# Altium schematic sheet Cpcis_connectors_P1_P2_P3.SchDoc: CPCIS Backplane
size 420 x 297 mm; CheckedBy: A.Paixao; CompanyName: CERN; DrawnBy: G. Daniluk; Engineer: G. Daniluk; Organization: CERN; Address1: European Organization for Nuclear Research; Address2: CH-1211 Genève 23 - Switzerland; DocumentNumber: 18; SheetNumber: 18; SheetTotal: 19; Title2: P1 to P4; DivGrp: BE/CO; Designer: G. Daniluk; EDA_Number: EDA-03828-V1-0; Projet: DIOT Demonstrator System Board (based on C-GEFE v1); ModifiedBy: G. Daniluk; CheckedDate: 18/06/2018; ProjectName: Distributed I/O Tier
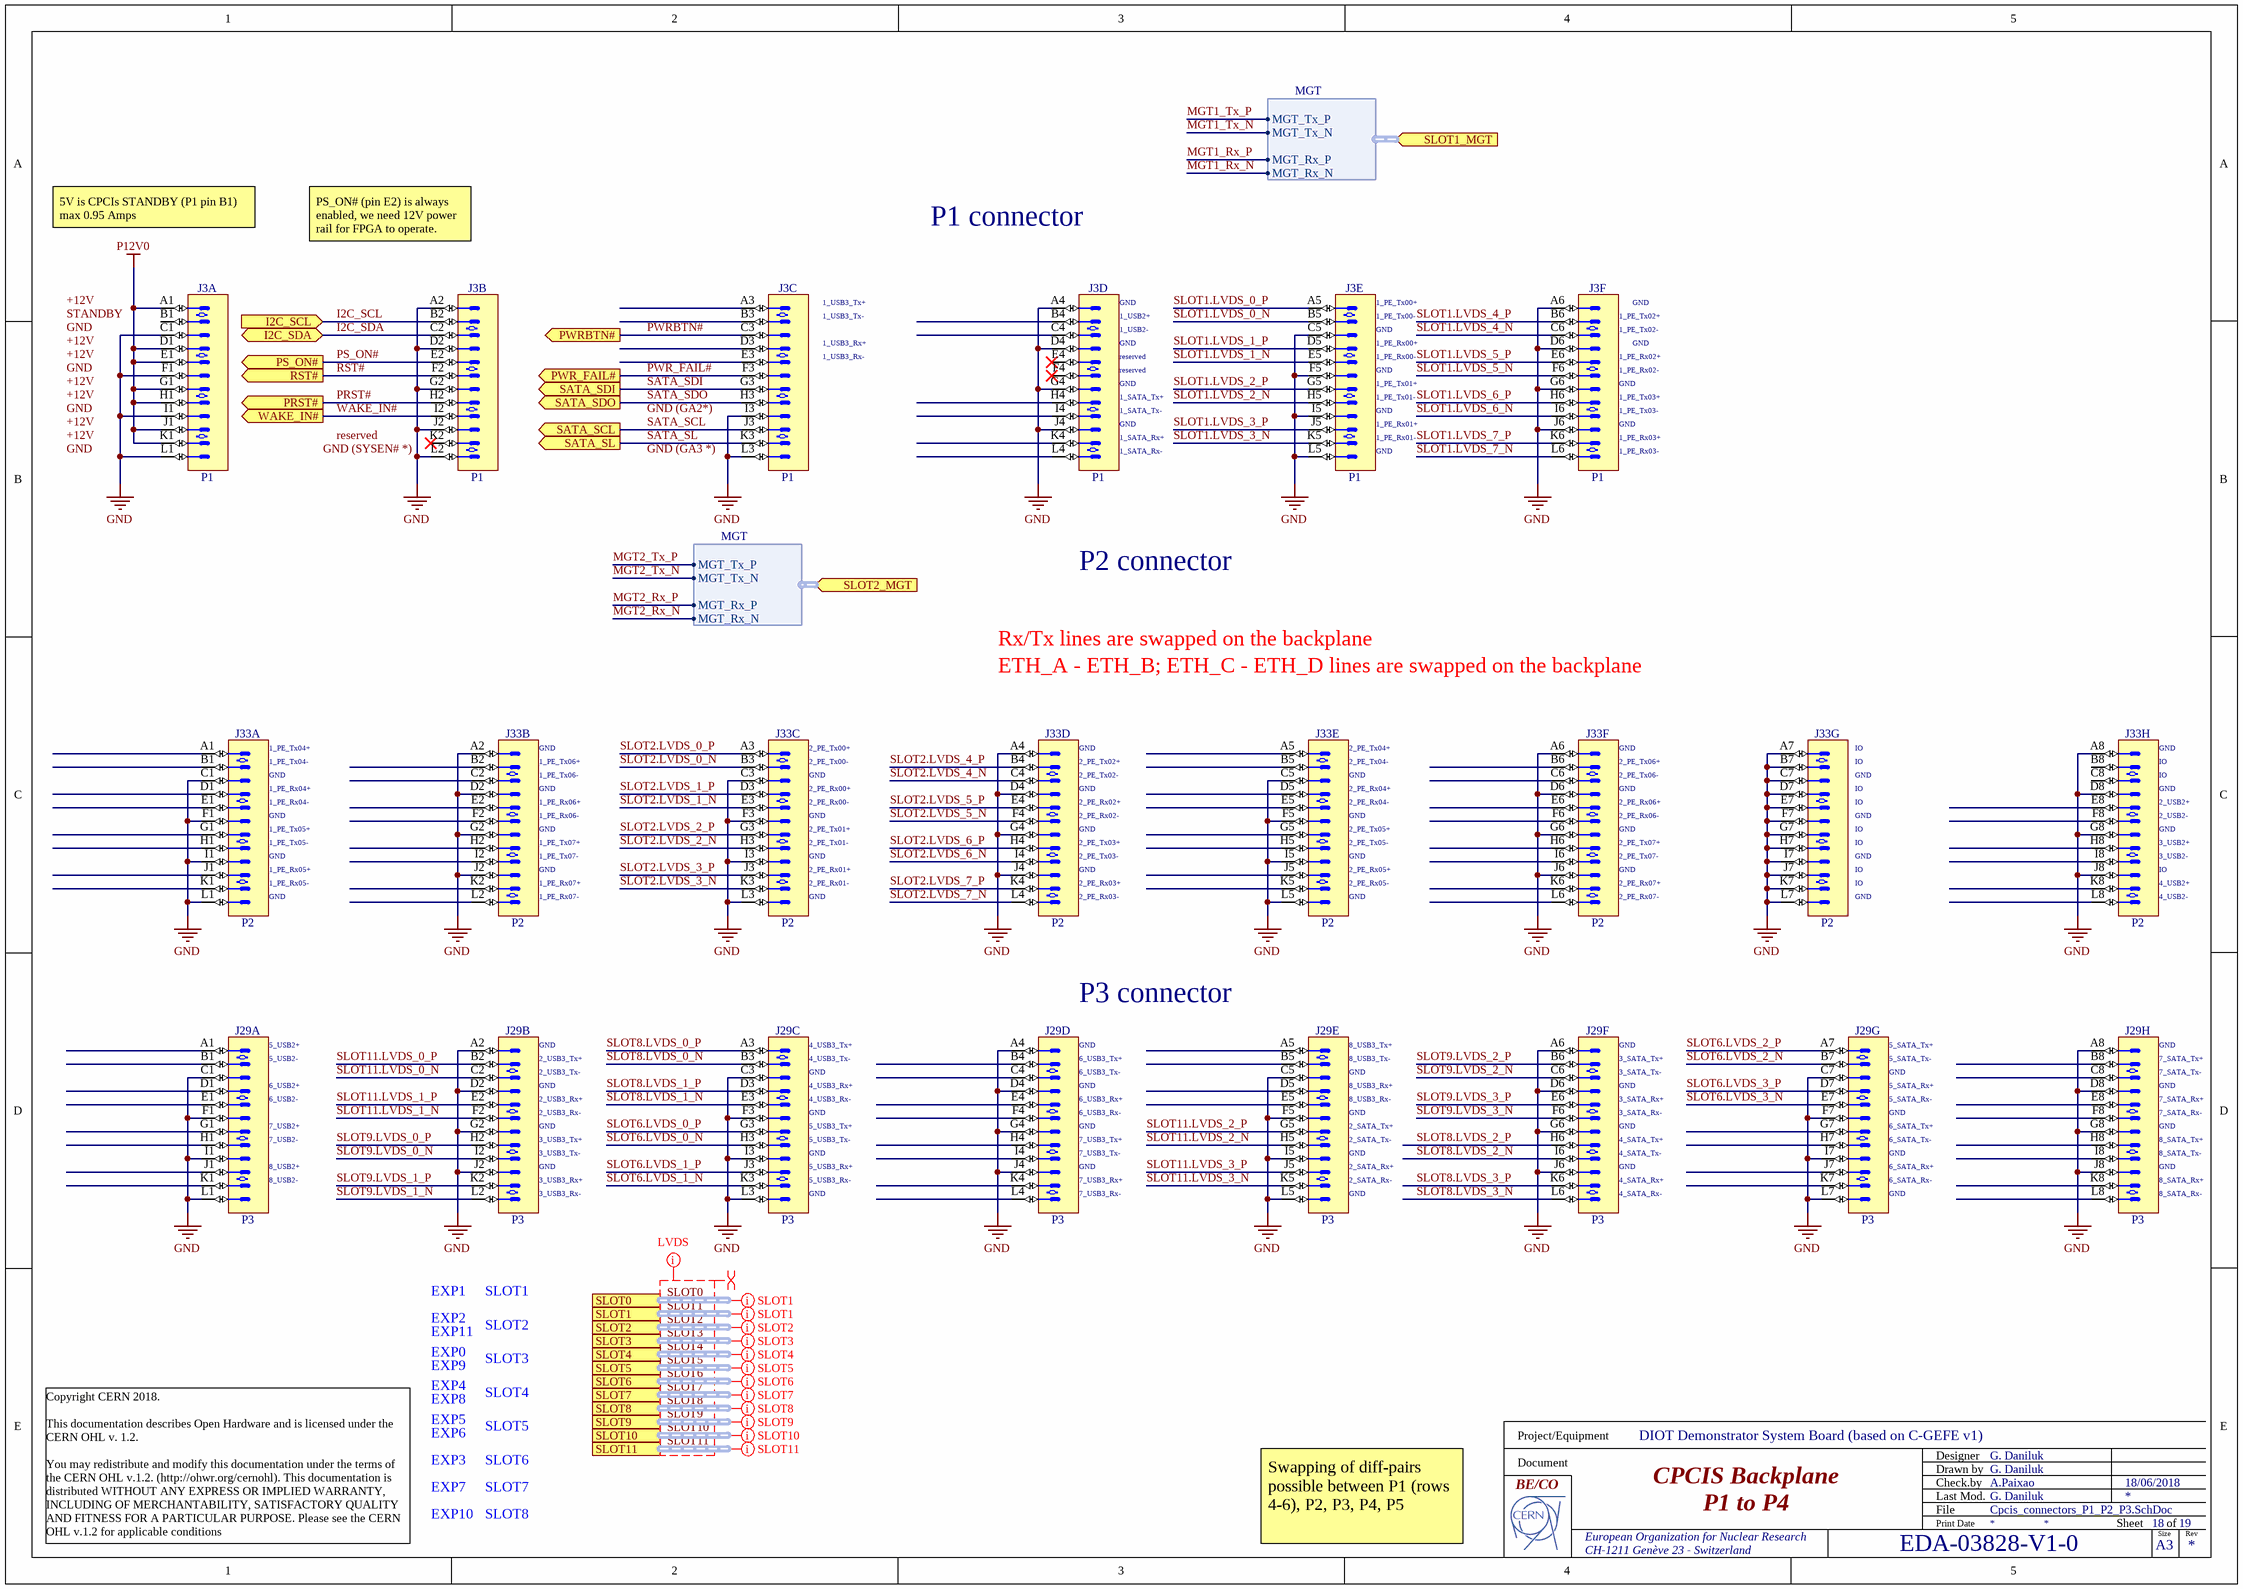
[diagram p0: Cpcis_connectors_P1_P2_P3.SchDoc]

## Parts
J3  P1  [AMPHENOL_10052825-101LF]  (parts A,B,C,D,E,F of 6)
J29  P3  [AMPHENOL_10052837-101LF]  (parts A,B,C,D,E,F,G,H of 8)
J33  P2  [AMPHENOL_10052837-101LF]  (parts A,B,C,D,E,F,G,H of 8)

## Ports
I2C_SCL (in), I2C_SDA (bidir), PRST# (out), PS_ON# (out), PWR_FAIL# (out), PWRBTN# (out), RST# (out), SATA_SCL (out), SATA_SDI (out), SATA_SDO (out), SATA_SL (out), SLOT0 (harness ExtensionConnector), SLOT1 (harness ExtensionConnector), SLOT1_MGT (in, harness MGT), SLOT2 (harness ExtensionConnector), SLOT2_MGT (in, harness MGT), SLOT3 (harness ExtensionConnector), SLOT4 (harness ExtensionConnector), SLOT5 (harness ExtensionConnector), SLOT6 (harness ExtensionConnector), SLOT7 (harness ExtensionConnector), SLOT8 (harness ExtensionConnector), SLOT9 (harness ExtensionConnector), SLOT10 (harness ExtensionConnector), SLOT11 (harness ExtensionConnector), WAKE_IN# (out)

## Harnesses
MGT: MGT_Tx_P, MGT_Tx_N, MGT_Rx_P, MGT_Rx_N

## Nets
GND: J3.A2 J3.A4 J3.A6 J3.C1 J3.C5 J3.D2 J3.D4 J3.D6 J3.F1 J3.F5 J3.G2 J3.G4 J3.G6 J3.I1 J3.I3 J3.I5 J3.J2 J3.J4 J3.J6 J3.L1 J3.L2 J3.L3 J3.L5 J29.A2 J29.A4 J29.A6 J29.A8 J29.C1 J29.C3 J29.C5 J29.C7 J29.D2 J29.D4 J29.D6 J29.D8 J29.F1 J29.F3 J29.F5 J29.F7 J29.G2 J29.G4 J29.G6 J29.G8 J29.I1 J29.I3 J29.I5 J29.I7 J29.J2 J29.J4 J29.J6 J29.J8 J29.L1 J29.L3 J29.L5 J29.L7 J33.A2 J33.A4 J33.A6 J33.A7 J33.A8 J33.B7 J33.C1 J33.C3 J33.C5 J33.C7 J33.D2 J33.D4 J33.D6 J33.D7 J33.D8 J33.E7 J33.F1 J33.F3 J33.F5 J33.F7 J33.G2 J33.G4 J33.G6 J33.G7 J33.G8 J33.H7 J33.I1 J33.I3 J33.I5 J33.I7 J33.J2 J33.J4 J33.J6 J33.J7 J33.J8 J33.K7 J33.L1 J33.L3 J33.L5 J33.L7
P12V0: J3.A1 J3.D1 J3.E1 J3.G1 J3.H1 J3.J1 J3.K1
I2C_SCL: J3.B2 ; port I2C_SCL
I2C_SDA: J3.C2 ; port I2C_SDA
MGT1_Rx_N: port SLOT1_MGT.MGT_Rx_N
MGT1_Rx_P: port SLOT1_MGT.MGT_Rx_P
MGT1_Tx_N: port SLOT1_MGT.MGT_Tx_N
MGT1_Tx_P: port SLOT1_MGT.MGT_Tx_P
MGT2_Rx_N: port SLOT2_MGT.MGT_Rx_N
MGT2_Rx_P: port SLOT2_MGT.MGT_Rx_P
MGT2_Tx_N: port SLOT2_MGT.MGT_Tx_N
MGT2_Tx_P: port SLOT2_MGT.MGT_Tx_P
PRST#: J3.H2 ; port PRST#
PS_ON#: J3.E2 ; port PS_ON#
PWR_FAIL#: J3.F3 ; port PWR_FAIL#
PWRBTN#: J3.C3 ; port PWRBTN#
RST#: J3.F2 ; port RST#
SATA_SCL: J3.J3 ; port SATA_SCL
SATA_SDI: J3.G3 ; port SATA_SDI
SATA_SDO: J3.H3 ; port SATA_SDO
SATA_SL: J3.K3 ; port SATA_SL
SLOT1.LVDS_0_N: J3.B5
SLOT1.LVDS_0_P: J3.A5
SLOT1.LVDS_1_N: J3.E5
SLOT1.LVDS_1_P: J3.D5
SLOT1.LVDS_2_N: J3.H5
SLOT1.LVDS_2_P: J3.G5
SLOT1.LVDS_3_N: J3.K5
SLOT1.LVDS_3_P: J3.J5
SLOT1.LVDS_4_N: J3.C6
SLOT1.LVDS_4_P: J3.B6
SLOT1.LVDS_5_N: J3.F6
SLOT1.LVDS_5_P: J3.E6
SLOT1.LVDS_6_N: J3.I6
SLOT1.LVDS_6_P: J3.H6
SLOT1.LVDS_7_N: J3.L6
SLOT1.LVDS_7_P: J3.K6
SLOT2.LVDS_0_N: J33.B3
SLOT2.LVDS_0_P: J33.A3
SLOT2.LVDS_1_N: J33.E3
SLOT2.LVDS_1_P: J33.D3
SLOT2.LVDS_2_N: J33.H3
SLOT2.LVDS_2_P: J33.G3
SLOT2.LVDS_3_N: J33.K3
SLOT2.LVDS_3_P: J33.J3
SLOT2.LVDS_4_N: J33.C4
SLOT2.LVDS_4_P: J33.B4
SLOT2.LVDS_5_N: J33.F4
SLOT2.LVDS_5_P: J33.E4
SLOT2.LVDS_6_N: J33.I4
SLOT2.LVDS_6_P: J33.H4
SLOT2.LVDS_7_N: J33.L4
SLOT2.LVDS_7_P: J33.K4
SLOT6.LVDS_0_N: J29.H3
SLOT6.LVDS_0_P: J29.G3
SLOT6.LVDS_1_N: J29.K3
SLOT6.LVDS_1_P: J29.J3
SLOT6.LVDS_2_N: J29.B7
SLOT6.LVDS_2_P: J29.A7
SLOT6.LVDS_3_N: J29.E7
SLOT6.LVDS_3_P: J29.D7
SLOT8.LVDS_0_N: J29.B3
SLOT8.LVDS_0_P: J29.A3
SLOT8.LVDS_1_N: J29.E3
SLOT8.LVDS_1_P: J29.D3
SLOT8.LVDS_2_N: J29.I6
SLOT8.LVDS_2_P: J29.H6
SLOT8.LVDS_3_N: J29.L6
SLOT8.LVDS_3_P: J29.K6
SLOT9.LVDS_0_N: J29.I2
SLOT9.LVDS_0_P: J29.H2
SLOT9.LVDS_1_N: J29.L2
SLOT9.LVDS_1_P: J29.K2
SLOT9.LVDS_2_N: J29.C6
SLOT9.LVDS_2_P: J29.B6
SLOT9.LVDS_3_N: J29.F6
SLOT9.LVDS_3_P: J29.E6
SLOT11.LVDS_0_N: J29.C2
SLOT11.LVDS_0_P: J29.B2
SLOT11.LVDS_1_N: J29.F2
SLOT11.LVDS_1_P: J29.E2
SLOT11.LVDS_2_N: J29.H5
SLOT11.LVDS_2_P: J29.G5
SLOT11.LVDS_3_N: J29.K5
SLOT11.LVDS_3_P: J29.J5
WAKE_IN#: J3.I2 ; port WAKE_IN#

Not connected (* = marked no-connect by the designer): J3 A3 B1 B3 B4 C4 D3 E3 E4* F4* H4 I4 K2* K4 L4; J29 A1 A5 B1 B4 B5 B8 C4 C8 D1 D5 E1 E4 E5 E8 F4 F8 G1 G7 H1 H4 H7 H8 I4 I8 J1 J7 K1 K4 K7 K8 L4 L8; J33 A1 A5 B1 B2 B5 B6 B8 C2 C6 C8 D1 D5 E1 E2 E5 E6 E8 F2 F6 F8 G1 G5 H1 H2 H5 H6 H8 I2 I6 I8 J1 J5 K1 K2 K5 K6 K8 L2 L6 L8

## Buses and harness runs
harness SLOT0 = port SLOT0
harness SLOT1 = port SLOT1
harness SLOT2 = port SLOT2
harness SLOT3 = port SLOT3
harness SLOT4 = port SLOT4
harness SLOT5 = port SLOT5
harness SLOT6 = port SLOT6
harness SLOT7 = port SLOT7
harness SLOT8 = port SLOT8
harness SLOT9 = port SLOT9
harness SLOT10 = port SLOT10
harness SLOT11 = port SLOT11

## Layout directives
net class LVDS: SLOT0, SLOT1, SLOT2, SLOT3, SLOT4, SLOT5, SLOT6, SLOT7, SLOT8, SLOT9, SLOT10, SLOT11
net class SLOT1: (no net found under the mark)
net class SLOT2: (no net found under the mark)
net class SLOT3: (no net found under the mark)
net class SLOT4: (no net found under the mark)
net class SLOT5: (no net found under the mark)
net class SLOT6: (no net found under the mark)
net class SLOT7: (no net found under the mark)
net class SLOT8: (no net found under the mark)
differential pair: SLOT0, SLOT1, SLOT2, SLOT3, SLOT4, SLOT5, SLOT6, SLOT7, SLOT8, SLOT9, SLOT10, SLOT11
net class SLOT9: (no net found under the mark)
net class SLOT10: (no net found under the mark)
net class SLOT11: (no net found under the mark)
net class SLOT0: (no net found under the mark)

## Notes on the sheet
- 5V is CPCIs STANDBY (P1 pin B1)
  max 0.95 Amps
- PS_ON# (pin E2) is always enabled, we need 12V power rail for FPGA to operate.
- P1 connector
- 1_USB3_Tx+
- 1_USB3_Tx-
- (near J3) 1_USB2+
- (near J3) GND
- (near J3) 1_PE_Tx00+
- (near J3) 1_PE_Tx00-
- (near J3) 1_PE_Tx02+
- GND
- 1_USB3_Rx+
- 1_USB3_Rx-
- (near J3) 1_USB2-
- (near J3) 1_SATA_Tx+
- (near J3) reserved
- (near J3) 1_PE_Tx01+
- (near J3) 1_PE_Tx01-
- (near J3) 1_PE_Rx00+
- (near J3) 1_PE_Rx00-
- (near J3) 1_PE_Tx02-
- (near J3) 1_PE_Rx02+
- (near J3) 1_PE_Rx02-
- (near J3) 1_PE_Tx03+
- (near J3) 1_SATA_Tx-
- (near J3) 1_SATA_Rx+
- (near J3) 1_SATA_Rx-
- (near J3) 1_PE_Rx01+
- (near J3) 1_PE_Rx01-
- (near J3) 1_PE_Tx03-
- (near J3) 1_PE_Rx03+
- (near J3) 1_PE_Rx03-
- P2 connector
- Rx/Tx lines are swapped on the backplane
- ETH_A - ETH_B; ETH_C - ETH_D lines are swapped on the backplane
- (near J33) 1_PE_Tx04+
- (near J33) 1_PE_Tx04-
- (near J33) GND
- (near J33) 1_PE_Rx04+
- (near J33) 1_PE_Rx04-
- (near J33) 1_PE_Tx06+
- (near J33) 1_PE_Tx06-
- (near J33) 1_PE_Rx06+
- (near J33) 2_PE_Tx00+
- (near J33) 2_PE_Tx00-
- (near J33) 2_PE_Rx00+
- (near J33) 2_PE_Rx00-
- (near J33) 2_PE_Tx02+
- (near J33) 2_PE_Tx02-
- (near J33) 2_PE_Rx02+
- (near J33) 2_PE_Tx04+
- (near J33) 2_PE_Tx04-
- (near J33) 2_PE_Rx04+
- (near J33) 2_PE_Rx04-
- (near J33) 2_PE_Tx06+
- (near J33) 2_PE_Tx06-
- (near J33) 2_PE_Rx06+
- (near J33) IO
- (near J33) 2_USB2+
- (near J33) 1_PE_Tx05+
- (near J33) 1_PE_Tx05-
- (near J33) 1_PE_Rx06-
- (near J33) 1_PE_Tx07+
- (near J33) 1_PE_Tx07-
- (near J33) 2_PE_Tx01+
- (near J33) 2_PE_Tx01-
- (near J33) 2_PE_Rx02-
- (near J33) 2_PE_Tx03+
- (near J33) 2_PE_Tx03-
- (near J33) 2_PE_Tx05+
- (near J33) 2_PE_Tx05-
- (near J33) 2_PE_Rx06-
- (near J33) 2_PE_Tx07+
- (near J33) 2_PE_Tx07-
- (near J33) 2_USB2-
- (near J33) 3_USB2+
- (near J33) 3_USB2-
- (near J33) 1_PE_Rx05+
- (near J33) 1_PE_Rx05-
- (near J33) 1_PE_Rx07+
- (near J33) 1_PE_Rx07-
- (near J33) 2_PE_Rx01+
- (near J33) 2_PE_Rx01-
- (near J33) 2_PE_Rx03+
- (near J33) 2_PE_Rx03-
- (near J33) 2_PE_Rx05+
- (near J33) 2_PE_Rx05-
- (near J33) 2_PE_Rx07+
- (near J33) 2_PE_Rx07-
- (near J33) 4_USB2+
- (near J33) 4_USB2-
- (near J29) 5_USB2+
- (near J29) 5_USB2-
- (near J29) GND
- (near J29) 2_USB3_Tx+
- (near J29) 2_USB3_Tx-
- (near J29) 4_USB3_Tx+
- (near J29) 4_USB3_Tx-
- P3 connector
- (near J29) 6_USB3_Tx+
- (near J29) 6_USB3_Tx-
- (near J29) 8_USB3_Tx+
- (near J29) 8_USB3_Tx-
- (near J29) 3_SATA_Tx+
- (near J29) 3_SATA_Tx-
- (near J29) 5_SATA_Tx+
- (near J29) 5_SATA_Tx-
- (near J29) 7_SATA_Tx+
- (near J29) 7_SATA_Tx-
- (near J29) 6_USB2+
- (near J29) 6_USB2-
- (near J29) 7_USB2+
- (near J29) 2_USB3_Rx+
- (near J29) 2_USB3_Rx-
- (near J29) 4_USB3_Rx+
- (near J29) 4_USB3_Rx-
- (near J29) 5_USB3_Tx+
- (near J29) 6_USB3_Rx+
- (near J29) 6_USB3_Rx-
- (near J29) 8_USB3_Rx+
- (near J29) 8_USB3_Rx-
- (near J29) 2_SATA_Tx+
- (near J29) 3_SATA_Rx+
- (near J29) 3_SATA_Rx-
- (near J29) 5_SATA_Rx+
- (near J29) 5_SATA_Rx-
- (near J29) 6_SATA_Tx+
- (near J29) 7_SATA_Rx+
- (near J29) 7_SATA_Rx-
- (near J29) 7_USB2-
- (near J29) 8_USB2+
- (near J29) 8_USB2-
- (near J29) 3_USB3_Tx+
- (near J29) 3_USB3_Tx-
- (near J29) 3_USB3_Rx+
- (near J29) 3_USB3_Rx-
- (near J29) 5_USB3_Tx-
- (near J29) 5_USB3_Rx+
- (near J29) 5_USB3_Rx-
- (near J29) 7_USB3_Tx+
- (near J29) 7_USB3_Tx-
- (near J29) 7_USB3_Rx+
- (near J29) 7_USB3_Rx-
- (near J29) 2_SATA_Tx-
- (near J29) 2_SATA_Rx+
- (near J29) 2_SATA_Rx-
- (near J29) 4_SATA_Tx+
- (near J29) 4_SATA_Tx-
- (near J29) 4_SATA_Rx+
- (near J29) 4_SATA_Rx-
- (near J29) 6_SATA_Tx-
- (near J29) 6_SATA_Rx+
- (near J29) 6_SATA_Rx-
- (near J29) 8_SATA_Tx+
- (near J29) 8_SATA_Tx-
- (near J29) 8_SATA_Rx+
- (near J29) 8_SATA_Rx-
- EXP1
- EXP2
- EXP11
- SLOT1
- SLOT2
- EXP4
- EXP8
- EXP9
- EXP0
- SLOT3
- SLOT4
- EXP3
- EXP5
- EXP6
- SLOT5
- SLOT6
- Copyright CERN 2018.
  This documentation describes Open Hardware and is licensed under the CERN OHL v. 1.2.
  You may redistribute and modify this documentation under the terms of the CERN OHL v.1.2. (http://ohwr.org/cernohl). This documentation is distributed WITHOUT ANY EXPRESS OR IMPLIED WARRANTY, INCLUDING OF MERCHANTABILITY, SATISFACTORY QUALITY AND FITNESS FOR A PARTICULAR PURPOSE. Please see the CERN OHL v.1.2 for applicable conditions
- EXP7
- EXP10
- SLOT7
- SLOT8
- Swapping of diff-pairs possible between P1 (rows 4-6), P2, P3, P4, P5
- Labels drawn without touching a wire or pin: +12V, GND, GND (GA2*), GND (GA3 *), GND (SYSEN# *), reserved, STANDBY
- Project/Equipment
- Document
- Designer
- Drawn by
- Check.by
- File
- Last Mod.
- Print Date
- Sheet
- Size
- A3
- of
- Rev

## Library data of the parts
J3 = AMPHENOL_10052825-101LF: 72 Contacts Header, 6 Columns, 4 Pairs per Column; Part Description: 72 Contacts, 2mm Pitch, 6 Columns, 4 Pairs per Column, 4 Walls, Right Angle Header; Part Number: AMPHENOL_10052825-101LF; Component Kind: Standard; Component Type: Standard; Pin Count: 72; Family: AirMax VS; Mounted: Yes; Socket: No; SMD: No; PressFit: Yes; Sense: No; Status: None; Manufacturer: AMPHENOL; Manufacturer Part Number: 10052825-101LF; ComponentHeight: 15.35mm; HelpURL: \\cern.ch\dfs\Applications\Altium\Datasheets\AMPHENOL_10052825-101LF.pdf; ComponentLink1URL: \\cern.ch\dfs\Applications\Altium\Datasheets\AMPHENOL_10052825-101LF_Application.pdf; ComponentLink1Description: Application; Author: CERN DEM MR; CreateDate: 19/02/2018; LatestRevisionDate: 19/02/2018; Classname: Overlapping
J29 J33 = AMPHENOL_10052837-101LF: 96 Contacts Header, 8 Columns, 4 Pairs per Column; Part Description: 96 Contacts, 2mm Pitch, 8 Columns, 4 Pairs per Column, 2 Walls, Right Angle Header; Part Number: AMPHENOL_10052837-101LF; Component Kind: Standard; Component Type: Standard; Pin Count: 96; Family: AirMax VS; Mounted: Yes; Socket: No; SMD: No; PressFit: Yes; Sense: No; Status: None; Manufacturer: AMPHENOL; Manufacturer Part Number: 10052837-101LF; ComponentHeight: 15.35mm; HelpURL: \\cern.ch\dfs\Applications\Altium\Datasheets\AMPHENOL_10052837-101LF.pdf; ComponentLink1URL: \\cern.ch\dfs\Applications\Altium\Datasheets\AMPHENOL_10052837-101LF_Application.pdf; ComponentLink1Description: Application; Author: CERN DEM MR; CreateDate: 19/02/2018; LatestRevisionDate: 19/02/2018